# EasyEDA schematic 1-Schematic_ESP32_Development_Board.json
TITLE: Esp32; REV: 1.0; Date: 2025-07-18; Sheet: 1/1; Drawn By: samarth_58; Company: Samarth
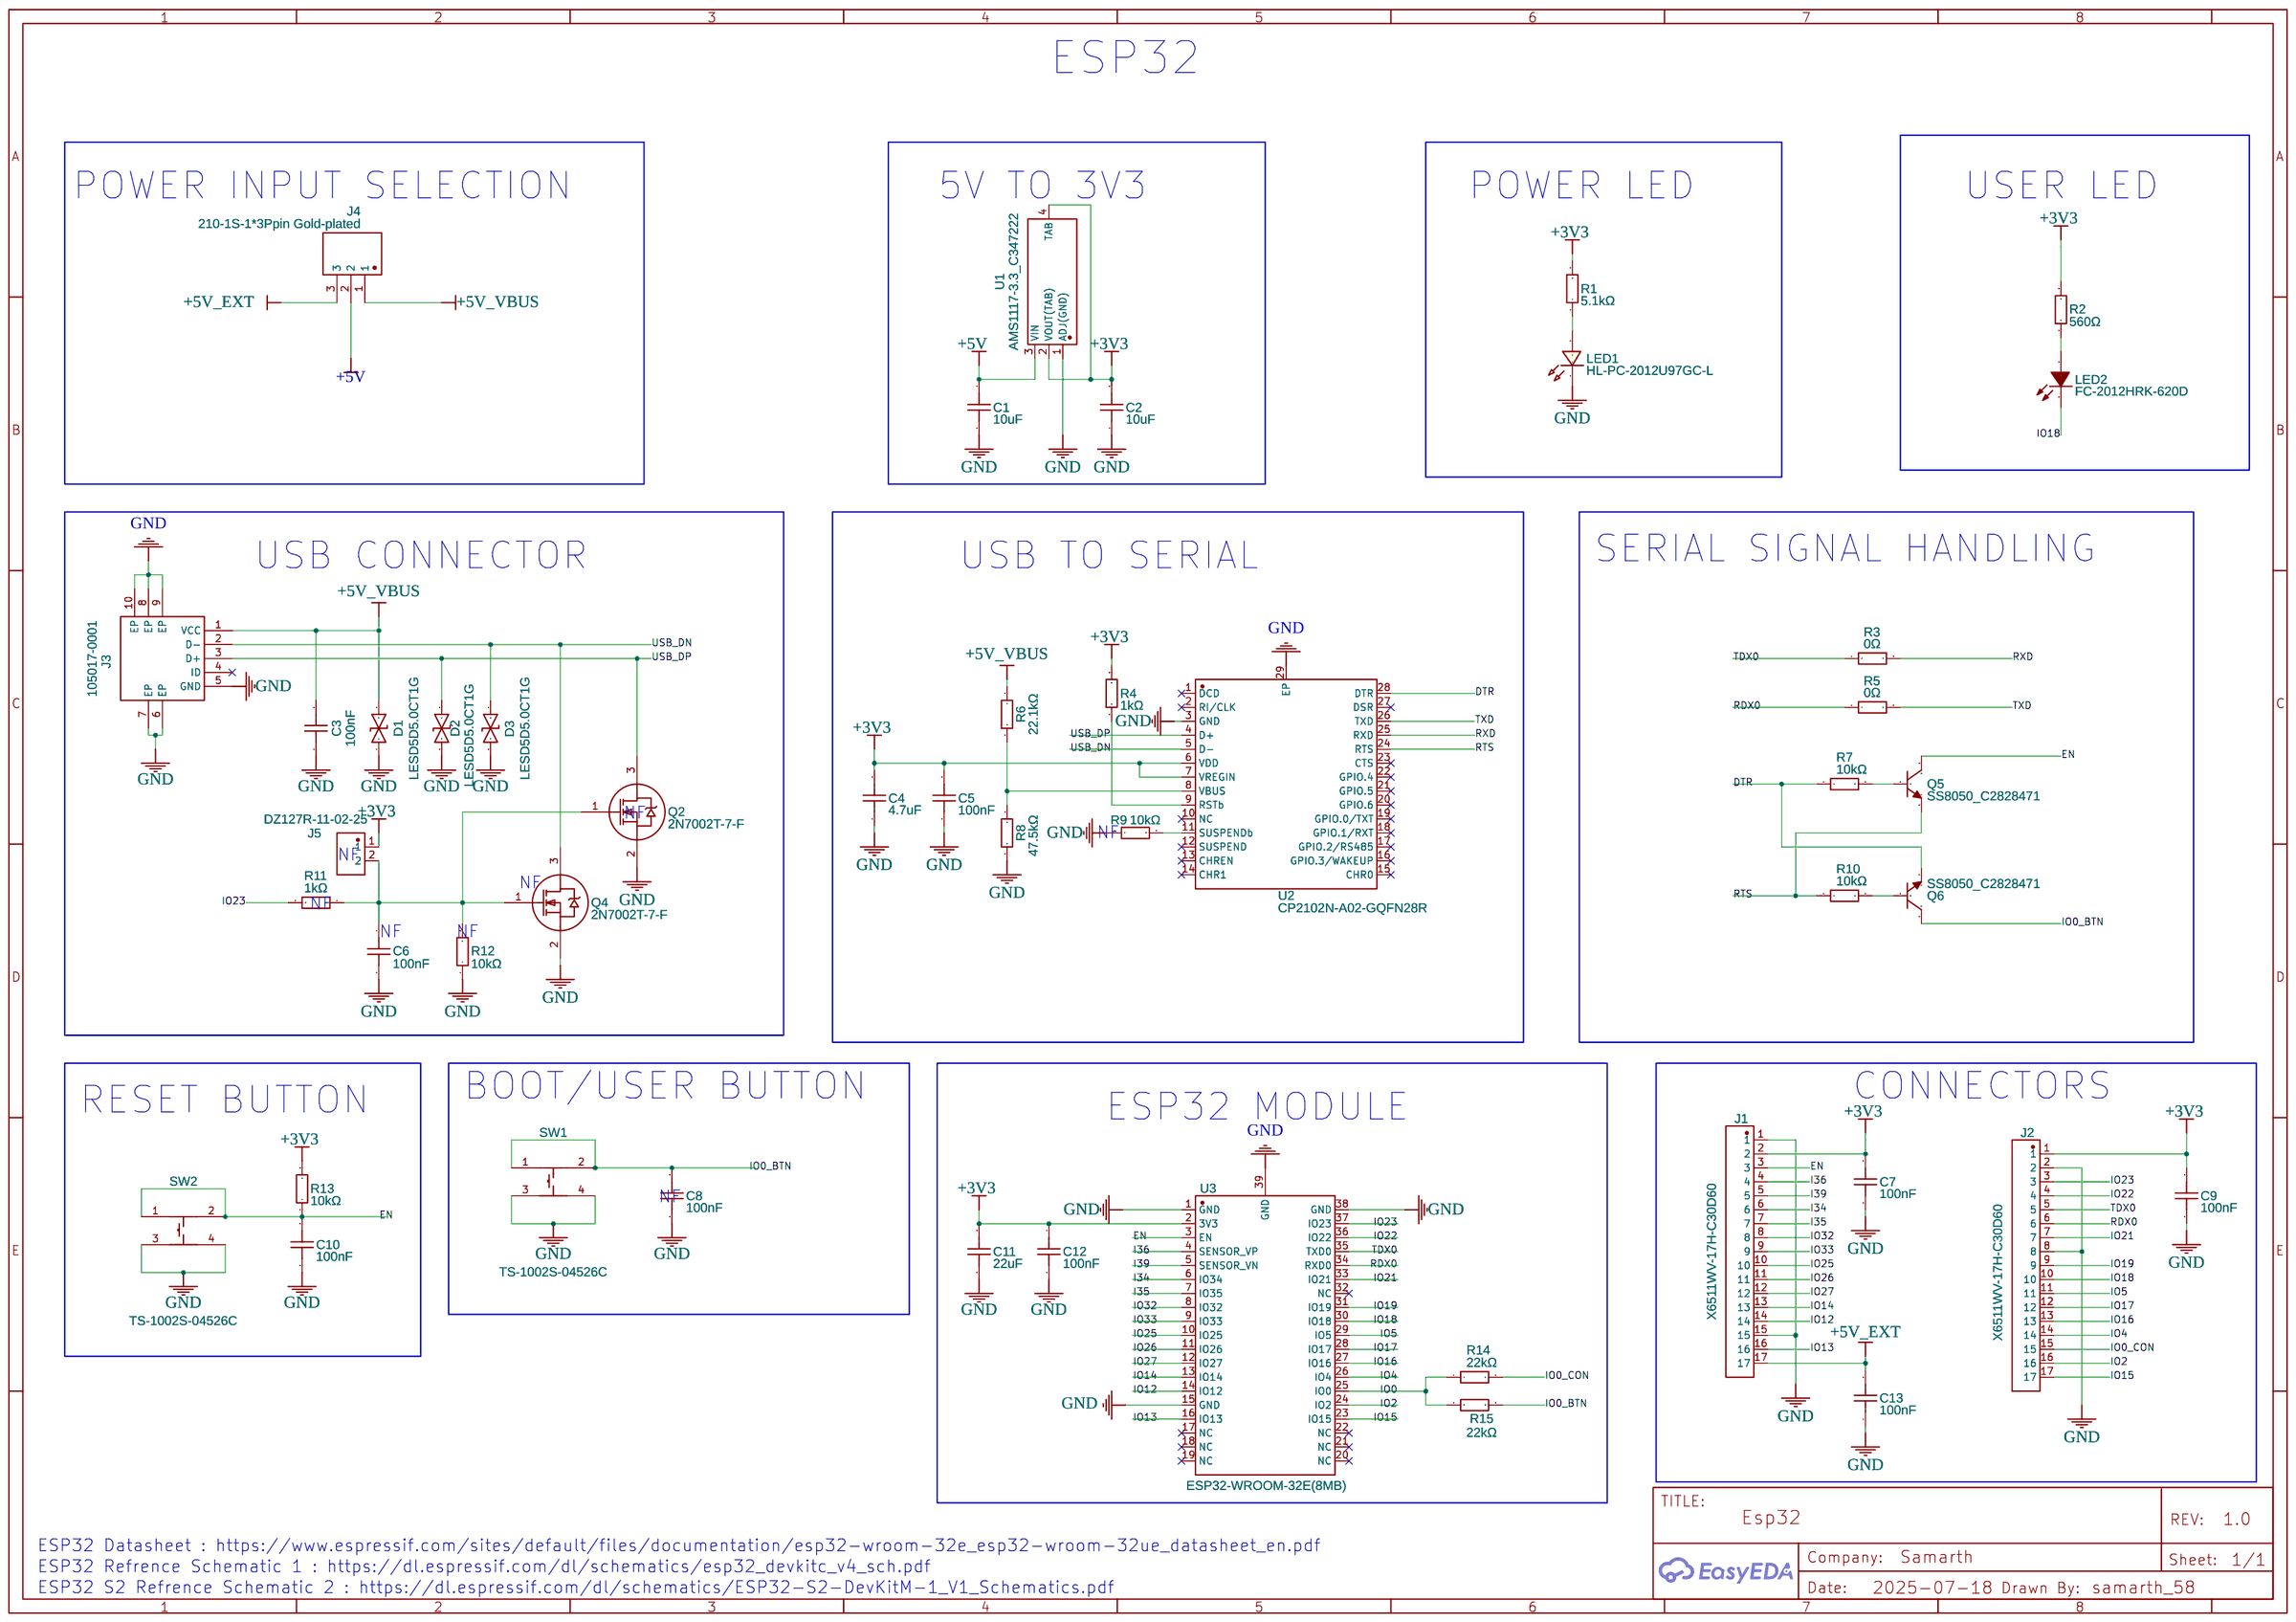
[diagram p0: schematic sheet]

## Parts
C1  10uF  [C0402]
C2  10uF  [C0402]
C3  100nF  [C0402]
C4  4.7uF  [C0402]
C5  100nF  [C0402]
C6  100nF  [C0402]
C7  100nF  [C0402]
C8  100nF  [C0402]
C9  100nF  [C0402]
C10  100nF  [C0402]
C11  22uF  [C0805]
C12  100nF  [C0402]
C13  100nF  [C0402]
D1  LESD5D5.0CT1G  [SOD-523_L1.2-W0.8-LS1.6-BI]
D2  LESD5D5.0CT1G  [SOD-523_L1.2-W0.8-LS1.6-BI]
D3  LESD5D5.0CT1G  [SOD-523_L1.2-W0.8-LS1.6-BI]
J1  X6511WV-17H-C30D60  [HDR-TH_17P-P2.54-V-M]
J2  X6511WV-17H-C30D60  [HDR-TH_17P-P2.54-V-M]
J3  105017-0001  [MICRO-USB-SMD_105017-0001]
J4  210-1S-1*3Ppin Gold-plated  [HDR-TH_3P-P1.27-V-M-1]
J5  DZ127R-11-02-25  [HDR-TH_2P-P1.27-V-M]
LED1  HL-PC-2012U97GC-L  [LED0805-RD_GREEN]
LED2  FC-2012HRK-620D  [LED0805-R-RD]
Q2  2N7002T-7-F  [SOT-523-3_L1.6-W0.8-P1.00-LS1.6-BR]
Q4  2N7002T-7-F  [SOT-523-3_L1.6-W0.8-P1.00-LS1.6-BR]
Q5  SS8050_C2828471  [SOT-23-3_L2.9-W1.4-0.95-LS2.5-BR]
Q6  SS8050_C2828471  [SOT-23-3_L2.9-W1.4-0.95-LS2.5-BR]
R1  5.1kΩ  [R0402]
R2  560Ω  [R0402]
R3  0Ω  [R0402]
R4  1kΩ  [R0402]
R5  0Ω  [R0402]
R6  22.1kΩ  [R0402]
R7  10kΩ  [R0402]
R8  47.5kΩ  [R0402]
R9  10kΩ  [R0402]
R10  10kΩ  [R0402]
R11  1kΩ  [R0402]
R12  10kΩ  [R0402]
R13  10kΩ  [R0402]
R14  22kΩ  [R0402]
R15  22kΩ  [R0402]
SW1  TS-1002S-04526C  [SW-SMD_4P-L6.0-W6.0-P4.50-LS9.0-2]
SW2  TS-1002S-04526C  [SW-SMD_4P-L6.0-W6.0-P4.50-LS9.0-2]
U1  AMS1117-3.3_C347222  [SOT-223-4_L6.5-W3.5-P2.30-LS7.0-BR]
U2  CP2102N-A02-GQFN28R  [QFN-28_L5.0-W5.0-P0.50-TL-EP3.3]
U3  ESP32-WROOM-32E(8MB)  [WIFI-SMD_ESP32-WROOM-32E]

## Library data of the parts
C1 C2 = CL05A106MP5NUNC_C315248: Contributor: LCSC; Supplier: LCSC; Supplier Part: C315248; Manufacturer: SAMSUNG(三星); Manufacturer Part: CL05A106MP5NUNC; JLCPCB Part Class: Extended Part
C3 C5-C10 C12 C13 = CL05B104KO5NNNC: Supplier: LCSC; Manufacturer: SAMSUNG(三星); Supplier Part: C1525; JLCPCB Part Class: Basic Part
C4 = CL05A475KP5NRNC: Contributor: LCSC; Supplier: LCSC; Supplier Part: C368809; Manufacturer: SAMSUNG(三星); JLCPCB Part Class: Extended Part
C11 = CL21A226MAYNNNE: Contributor: LCSC; Supplier: LCSC; Supplier Part: C602037; Manufacturer: SAMSUNG(三星); JLCPCB Part Class: Extended Part
D1-D3 = LESD5D5.0CT1G: Contributor: LCSC; Supplier: LCSC; Supplier Part: C383211; Manufacturer: LRC(乐山无线电); JLCPCB Part Class: Extended Part
J1 J2 = X6511WV-17H-C30D60: Contributor: LCSC; Supplier: LCSC; Supplier Part: C725949; Manufacturer: XKB Connection(中国星坤); Manufacturer Part: X6511WV-17H-C60D30; JLCPCB Part Class: Extended Part
J3 = 105017-0001: Contributor: LCSC; Supplier: LCSC; Manufacturer: MOLEX; Manufacturer Part: 1050170001; Supplier Part: C136000; JLCPCB Part Class: Extended Part
J4 = 210-1S-1*3Ppin Gold-plated: Contributor: LCSC; Supplier: LCSC; Manufacturer: Ckmtw(灿科盟); Manufacturer Part: B-2101S03P-A110; Supplier Part: C124354; JLCPCB Part Class: Extended Part
J5 = DZ127R-11-02-25: Contributor: LCSC; Supplier: LCSC; Supplier Part: C2935942; Manufacturer: DEALON(德艺隆); JLCPCB Part Class: Extended Part
LED1 = HL-PC-2012U97GC-L: Contributor: LCSC; Supplier: LCSC; Supplier Part: C497941; Manufacturer: HONGLITRONIC(鸿利光电); JLCPCB Part Class: Extended Part
LED2 = FC-2012HRK-620D: Supplier: LCSC; Manufacturer: 国星光电; Manufacturer Part: NCD0805R1; Supplier Part: C84256; JLCPCB Part Class: Basic Part
Q2 Q4 = 2N7002T-7-F: Contributor: LCSC; Supplier: LCSC; Manufacturer: DIODES(美台); Supplier Part: C139445; JLCPCB Part Class: Extended Part
Q5 Q6 = SS8050_C2828471: Contributor: LCSC; Supplier: LCSC; Supplier Part: C2828471; Manufacturer: CBI(创基); Manufacturer Part: SS8050; JLCPCB Part Class: Extended Part
R1 = 0402WGF5101TCE: Supplier: LCSC; Manufacturer: UNI-ROYAL(厚声); Supplier Part: C25905; JLCPCB Part Class: Basic Part
R2 = 0402WGF5600TCE: Supplier: LCSC; Manufacturer: UNI-ROYAL(厚声); Supplier Part: C25126; JLCPCB Part Class: Extended Part
R3 R5 = 0402WGF0000TCE: Supplier: LCSC; Manufacturer: UNI-ROYAL(厚声); Supplier Part: C17168; JLCPCB Part Class: Basic Part
R4 R11 = 0402WGF1001TCE: Supplier: LCSC; Manufacturer: UNI-ROYAL(厚声); Supplier Part: C11702; JLCPCB Part Class: Basic Part
R6 = 0402WGF2212TCE: Supplier: LCSC; Manufacturer: UNI-ROYAL(厚声); Supplier Part: C43473; JLCPCB Part Class: Extended Part
R7 R9 R10 R12 R13 = 0402WGF1002TCE: Supplier: LCSC; Manufacturer: UNI-ROYAL(厚声); Supplier Part: C25744; JLCPCB Part Class: Basic Part
R8 = 0402WGF4752TCE: Supplier: LCSC; Manufacturer: UNI-ROYAL(厚声); Supplier Part: C25896; JLCPCB Part Class: Extended Part
R14 R15 = 0402WGF2202TCE: Supplier: LCSC; Manufacturer: UNI-ROYAL(厚声); Supplier Part: C25768; JLCPCB Part Class: Basic Part
SW1 SW2 = TS-1002S-04526C: Contributor: LCSC; Supplier: LCSC; Supplier Part: C455109; Manufacturer: XUNPU(讯普); JLCPCB Part Class: Extended Part
U1 = AMS1117-3.3_C347222: Contributor: LCSC; Supplier: LCSC; Supplier Part: C347222; Manufacturer: UMW(友台半导体); Manufacturer Part: AMS1117-3.3; JLCPCB Part Class: Extended Part
U2 = CP2102N-A02-GQFN28R: Contributor: LCSC; Supplier: LCSC; Supplier Part: C964632; Manufacturer: SKYWORKS/SILICON LABS(芯科); JLCPCB Part Class: Extended Part
U3 = ESP32-WROOM-32E(8MB): Contributor: LCSC; Supplier: LCSC; Supplier Part: C701342; Manufacturer: ESPRESSIF(乐鑫); Manufacturer Part: ESP32-WROOM-32E-N8; JLCPCB Part Class: Extended Part

## Nets
+3V3: C2.2 C4.2 C5.2 C7.2 C9.2 C11.2 C12.2 J1.2 J2.1 J5.1 R1.2 R2.2 R4.2 R13.2 U1.2(VOUT(TAB)) U1.4(TAB) U2.6(VDD) U2.7(VREGIN) U3.2(3V3)
+5V: C1.2 J4.2 U1.3(VIN)
+5V_EXT: C13.2 J1.17 J4.3
+5V_VBUS: C3.2 D1.2 J3.1(VCC) J4.1 R6.2
GND: C1.1 C2.1 C3.1 C4.1 C5.1 C6.2 C7.1 C8.1 C9.1 C10.1 C11.1 C12.1 C13.1 D1.1 D2.2 D3.2 J1.1 J1.15 J2.2 J2.8 J3.5(GND) J3.6(EP) J3.7(EP) J3.8(EP) J3.9(EP) J3.10(EP) LED1.1(-) Q2.2(S) Q4.2(S) R8.1 R9.1 R12.1 SW1.3 SW1.4 SW2.3 SW2.4 U1.1(ADJ(GND)) U2.3(GND) U2.29(EP) U3.1(GND) U3.15(GND) U3.38(GND) U3.39(GND)
DTR: Q6.2(E) R7.1 U2.28(DTR)
EN: C10.2 J1.3 Q5.3(C) R13.1 SW2.1 SW2.2 U3.3(EN)
I34: J1.6 U3.6(IO34)
I35: J1.7 U3.7(IO35)
I36: J1.4 U3.4(SENSOR_VP)
I39: J1.5 U3.5(SENSOR_VN)
IO0: R14.1 R15.1 U3.25(IO0)
IO0_BTN: C8.2 Q6.3(C) R15.2 SW1.1 SW1.2
IO0_CON: J2.15 R14.2
IO2: J2.16 U3.24(IO2)
IO4: J2.14 U3.26(IO4)
IO5: J2.11 U3.29(IO5)
IO12: J1.14 U3.14(IO12)
IO13: J1.16 U3.16(IO13)
IO14: J1.13 U3.13(IO14)
IO15: J2.17 U3.23(IO15)
IO16: J2.13 U3.27(IO16)
IO17: J2.12 U3.28(IO17)
IO18: J2.10 LED2.2(-) U3.30(IO18)
IO19: J2.9 U3.31(IO19)
IO21: J2.7 U3.33(IO21)
IO22: J2.4 U3.36(IO22)
IO23: J2.3 R11.2 U3.37(IO23)
IO25: J1.10 U3.10(IO25)
IO26: J1.11 U3.11(IO26)
IO27: J1.12 U3.12(IO27)
IO32: J1.8 U3.8(IO32)
IO33: J1.9 U3.9(IO33)
RDX0: J2.6 R5.1 U3.34(RXD0)
RTS: Q5.2(E) R10.1 U2.24(RTS)
RXD: R3.2 U2.25(RXD)
TDX0: J2.5 R3.1 U3.35(TXD0)
TXD: R5.2 U2.26(TXD)
USB_DN: D3.1 J3.2(D-) Q4.3(D) U2.5(D-)
USB_DP: D2.1 J3.3(D+) Q2.3(D) U2.4(D+)
Net-(C6-1): C6.1 J5.2 Q2.1(G) Q4.1(G) R11.1 R12.2
Net-(LED1-2): LED1.2(+) R1.1
Net-(LED2-1): LED2.1(+) R2.1
Net-(Q5-1): Q5.1(B) R7.2
Net-(Q6-1): Q6.1(B) R10.2
Net-(R4-1): R4.1 U2.9(RSTb)
Net-(R6-1): R6.1 R8.2 U2.8(VBUS)
Net-(R9-2): R9.2 U2.11(SUSPENDb)

Not connected (* = marked no-connect by the designer): J3 4(ID)*; U2 1(DCD)* 2(RI/CLK)* 10(NC)* 12(SUSPEND)* 13(CHREN)* 14(CHR1)* 15(CHR0)* 16(GPIO.3/WAKEUP)* 17(GPIO.2/RS485)* 18(GPIO.1/RXT)* 19(GPIO.0/TXT)* 20(GPIO.6)* 21(GPIO.5)* 22(GPIO.4)* 23(CTS)* 27(DSR)*; U3 17(NC)* 18(NC)* 19(NC)* 20(NC)* 21(NC)* 22(NC)* 32(NC)*

## Notes on the sheet
- ESP32
- POWER INPUT SELECTION
- 5V TO 3V3
- POWER LED
- USER LED
- USB CONNECTOR
- USB TO SERIAL
- SERIAL SIGNAL HANDLING
- NF
- NF
- NF
- NF
- NF
- NF
- NF
- BOOT/USER BUTTON
- CONNECTORS
- RESET BUTTON
- ESP32 MODULE
- NF
- ESP32 Datasheet : https://www.espressif.com/sites/default/files/documentation/esp32-wroom-32e_esp32-wroom-32ue_datasheet_en.pdf
- ESP32 Refrence Schematic 1 : https://dl.espressif.com/dl/schematics/esp32_devkitc_v4_sch.pdf
- ESP32 S2 Refrence Schematic 2 : https://dl.espressif.com/dl/schematics/ESP32-S2-DevKitM-1_V1_Schematics.pdf
